# Altium schematic sheet PWM_Sensor.SchDoc
size A4
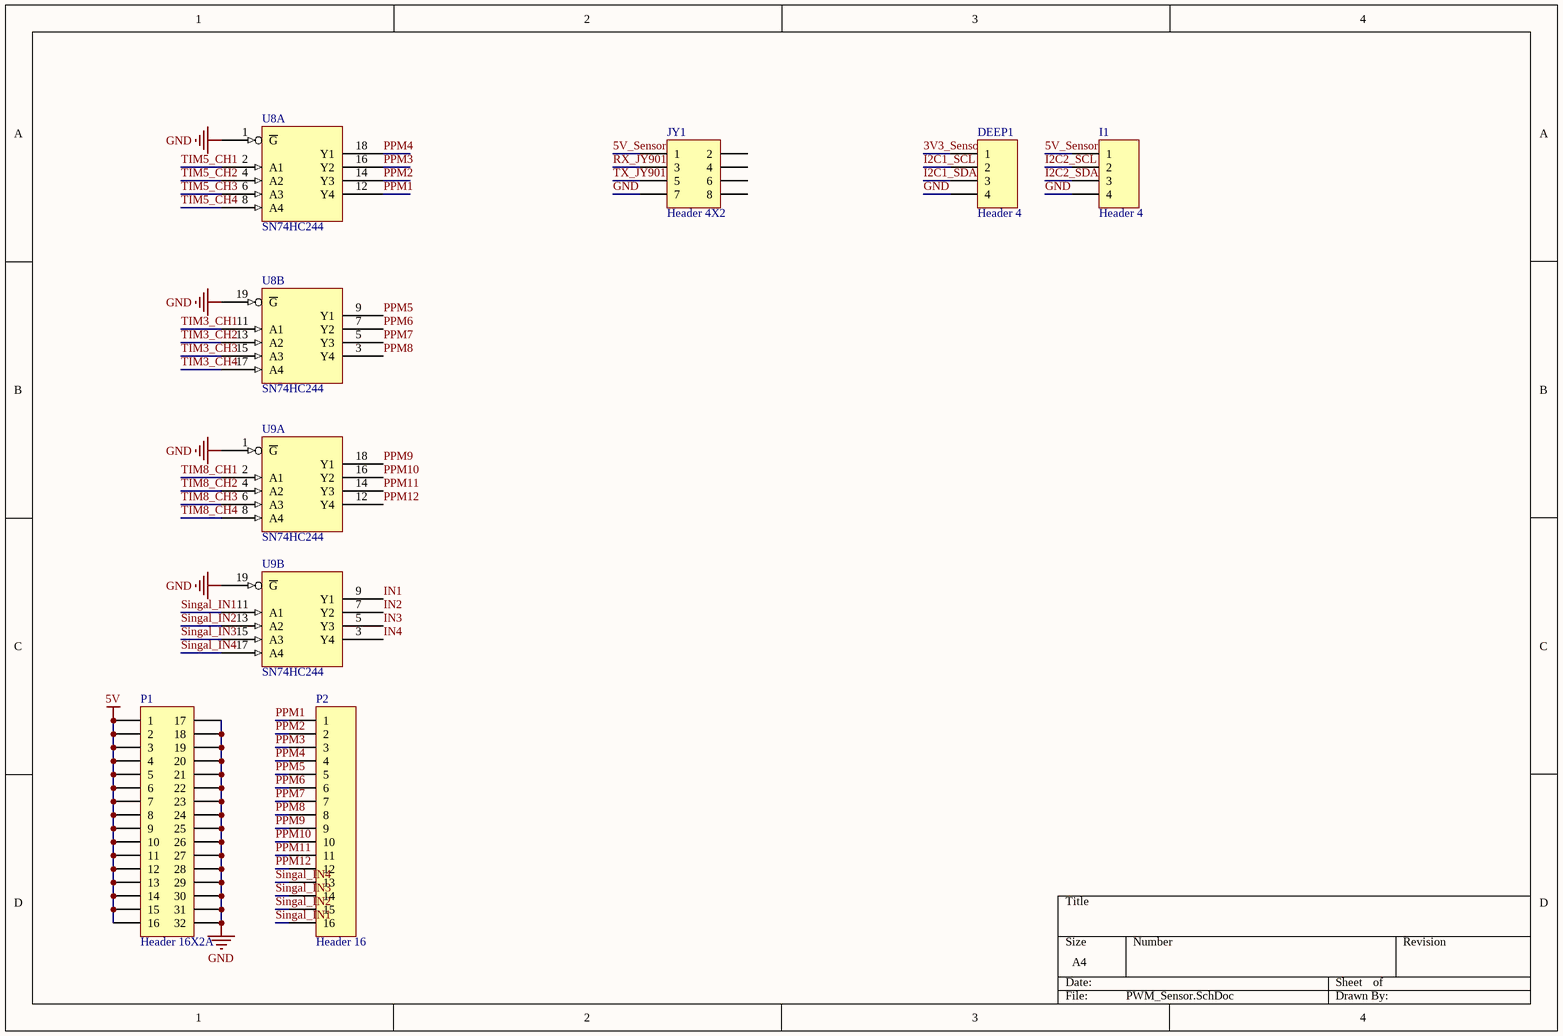
[diagram p0: PWM_Sensor.SchDoc]

## Parts
DEEP1  Header 4  [XH2.54_4P]
I1  Header 4  [XH2.54_4P]
JY1  Header 4X2  [JY901_2]
P1  Header 16X2A  [HDR2X16_CEN]
P2  Header 16  [HDR1X16]
U8  SN74HC244  [SOIC-20_300mil]  (parts A,B of 2)
U9  SN74HC244  [SOIC-20_300mil]  (parts A,B of 2)

## Nets
3V3: U8.20(VCC) U9.20(VCC)
5V: P1.1 P1.2 P1.3 P1.4 P1.5 P1.6 P1.7 P1.8 P1.9 P1.10 P1.11 P1.12 P1.13 P1.14 P1.15 P1.16
GND: DEEP1.4 I1.4 JY1.7 P1.17 P1.18 P1.19 P1.20 P1.21 P1.22 P1.23 P1.24 P1.25 P1.26 P1.27 P1.28 P1.29 P1.30 P1.31 P1.32 U8.1(~{G}) U8.10(GND) U8.19(~{G}) U9.1(~{G}) U9.10(GND) U9.19(~{G})
3V3_Sensor: DEEP1.1
5V_Sensor: I1.1 JY1.1
I2C1_SCL: DEEP1.2
I2C1_SDA: DEEP1.3
I2C2_SCL: I1.2
I2C2_SDA: I1.3
IN1: U9.9(Y1)
IN2: U9.7(Y2)
IN3: U9.5(Y3)
IN4: U9.3(Y4)
PPM1: P2.1 U8.12(Y4)
PPM2: P2.2 U8.14(Y3)
PPM3: P2.3 U8.16(Y2)
PPM4: P2.4 U8.18(Y1)
PPM5: P2.5 U8.9(Y1)
PPM6: P2.6 U8.7(Y2)
PPM7: P2.7 U8.5(Y3)
PPM8: P2.8 U8.3(Y4)
PPM9: P2.9 U9.18(Y1)
PPM10: P2.10 U9.16(Y2)
PPM11: P2.11 U9.14(Y3)
PPM12: P2.12 U9.12(Y4)
RX_JY901: JY1.3
Singal_IN1: P2.16 U9.11(A1)
Singal_IN2: P2.15 U9.13(A2)
Singal_IN3: P2.14 U9.15(A3)
Singal_IN4: P2.13 U9.17(A4)
TIM3_CH1: U8.11(A1)
TIM3_CH2: U8.13(A2)
TIM3_CH3: U8.15(A3)
TIM3_CH4: U8.17(A4)
TIM5_CH1: U8.2(A1)
TIM5_CH2: U8.4(A2)
TIM5_CH3: U8.6(A3)
TIM5_CH4: U8.8(A4)
TIM8_CH1: U9.2(A1)
TIM8_CH2: U9.4(A2)
TIM8_CH3: U9.6(A3)
TIM8_CH4: U9.8(A4)
TX_JY901: JY1.5

Not connected (* = marked no-connect by the designer): JY1 2 4 6 8

## Library data of the parts
DEEP1 I1 = Header 4: Header, 4-Pin; LatestRevisionDate: 17-Jul-2002; LatestRevisionNote: Re-released for DXP Platform.; Publisher: Altium Limited
JY1 = Header 4X2: Header, 4-Pin, Dual row; LatestRevisionDate: 17-Jul-2002; LatestRevisionNote: Re-released for DXP Platform.; Publisher: Altium Limited
P1 = Header 16X2A: Header, 16-Pin, Dual row; LatestRevisionDate: 17-Jul-2002; LatestRevisionNote: Re-released for DXP Platform.; Publisher: Altium Limited
P2 = Header 16: Header, 16-Pin; LatestRevisionDate: 17-Jul-2002; LatestRevisionNote: Re-released for DXP Platform.; Publisher: Altium Limited
U8 U9 = SN74HC244: OCTAL BUF AND LIN DRV 3SO